# Altium schematic sheet POWER_CORE.SchDoc
size A4
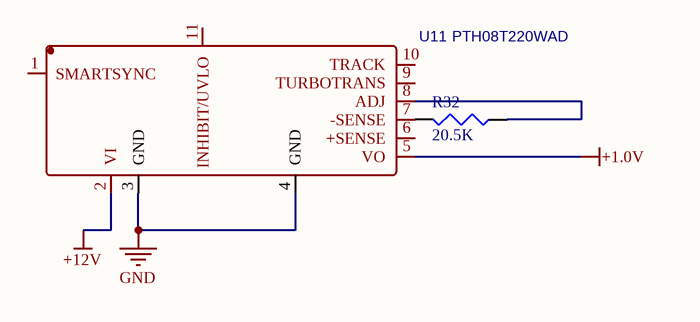
[diagram p0: POWER_CORE.SchDoc]

## Parts
R32  value 20.5K  [J1-0603]  (hidden comment: Res3)
U11  PTH08T220WAD  [PWRM-TH_11P-L23.1-W19.9-P3.17]

## Nets
+1.0V: U11.5(VO)
+12V: U11.2(VI)
GND: U11.3(GND) U11.4(GND)
NetR32_1: R32.1 U11.8(ADJ)
NetR32_2: R32.2 U11.7(-SENSE)

Not connected (* = marked no-connect by the designer): U11 1(SMARTSYNC) 6(+SENSE) 9(TURBOTRANS) 10(TRACK) 11(INHIBIT/UVLO)

## Library data of the parts
R32 = Res3: Resistor; Published: 8-Jun-2000; LatestRevisionDate: 29-May-2009; LatestRevisionNote: IPC-7351 Footprint Added.; PackageReference: J1-0603; Publisher: Altium Limited; PackageDescription: Chip Resistor
U11 = PTH08T220WAD: BOM_Manufacturer: Texas Instruments; Contributor: LCSC; BOM_Supplier: LCSC; BOM_Supplier Part: C79289; BOM_Manufacturer Part: PTH08T220WAD; spicePre: U; spiceSymbolName: PTH08T220WAD